# Altium project Solar Panel Cubesat.PrjPcb
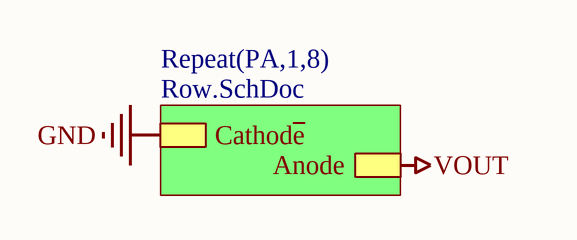
[diagram p0: Panel.SchDoc]
2 sheets, 208 parts. Net scope: hierarchical (ports join the sheet entries above them; power ports are global).
Board file: Panel.PcbDoc
Sheets:
  Panel.SchDoc
    PA1 = Row.SchDoc
    PA2 = Row.SchDoc
    PA3 = Row.SchDoc
    PA4 = Row.SchDoc
    PA5 = Row.SchDoc
    PA6 = Row.SchDoc
    PA7 = Row.SchDoc
    PA8 = Row.SchDoc

## Sheet Panel.SchDoc
size A4

### Sub-sheets
Repeat(PA,1,8) = Row.SchDoc: Cathod~{e}, Anode

## Sheet Row.SchDoc
size A4
Used 8 times, as channels PA1, PA2, PA3, PA4, PA5, PA6, PA7, PA8. Parts and nets are listed once, with the designators drawn on the sheet.
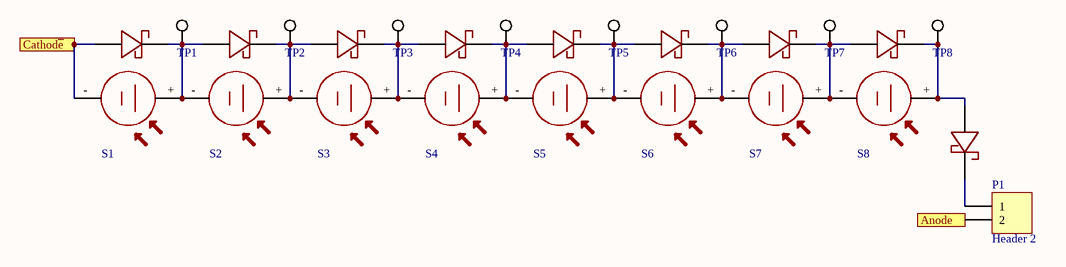
[diagram p1: Row.SchDoc]

### Parts
D1  SCHOTTKY_DIODE_B120-FDICT-NDSCHOTTKY_DIODE_B120-FDICT-ND  [SB_DIODE]  (value not drawn)
D2  SCHOTTKY_DIODE_B120-FDICT-NDSCHOTTKY_DIODE_B120-FDICT-ND  [SB_DIODE]  (value not drawn)
D3  SCHOTTKY_DIODE_B120-FDICT-NDSCHOTTKY_DIODE_B120-FDICT-ND  [SB_DIODE]  (value not drawn)
D4  SCHOTTKY_DIODE_B120-FDICT-NDSCHOTTKY_DIODE_B120-FDICT-ND  [SB_DIODE]  (value not drawn)
D5  SCHOTTKY_DIODE_B120-FDICT-NDSCHOTTKY_DIODE_B120-FDICT-ND  [SB_DIODE]  (value not drawn)
D6  SCHOTTKY_DIODE_B120-FDICT-NDSCHOTTKY_DIODE_B120-FDICT-ND  [SB_DIODE]  (value not drawn)
D7  SCHOTTKY_DIODE_B120-FDICT-NDSCHOTTKY_DIODE_B120-FDICT-ND  [SB_DIODE]  (value not drawn)
D8  SCHOTTKY_DIODE_B120-FDICT-NDSCHOTTKY_DIODE_B120-FDICT-ND  [SB_DIODE]  (value not drawn)
D9  SCHOTTKY_DIODE_B120-FDICT-NDSCHOTTKY_DIODE_B120-FDICT-ND  [SB_DIODE]  (value not drawn)
P1  Header 2  [HDR1X2]
S1  SOLAR_CELL  [SOLAR_CELL]  (value not drawn)
S2  SOLAR_CELL  [SOLAR_CELL]  (value not drawn)
S3  SOLAR_CELL  [SOLAR_CELL]  (value not drawn)
S4  SOLAR_CELL  [SOLAR_CELL]  (value not drawn)
S5  SOLAR_CELL  [SOLAR_CELL]  (value not drawn)
S6  SOLAR_CELL  [SOLAR_CELL]  (value not drawn)
S7  SOLAR_CELL  [SOLAR_CELL]  (value not drawn)
S8  SOLAR_CELL  [SOLAR_CELL]  (value not drawn)
TP1  TEST_POINT  [TEST_POINT]  (value not drawn)
TP2  TEST_POINT  [TEST_POINT]  (value not drawn)
TP3  TEST_POINT  [TEST_POINT]  (value not drawn)
TP4  TEST_POINT  [TEST_POINT]  (value not drawn)
TP5  TEST_POINT  [TEST_POINT]  (value not drawn)
TP6  TEST_POINT  [TEST_POINT]  (value not drawn)
TP7  TEST_POINT  [TEST_POINT]  (value not drawn)
TP8  TEST_POINT  [TEST_POINT]  (value not drawn)

### Ports
Anode, Cathod~{e}

### Nets
Anode: P1.2 ; port Anode
Cathod~{e}: D1.POS S1.- ; port Cathod~{e}
NetD1_NEG: D1.NEG D2.POS S1.+ S2.- TP1.38
NetD2_NEG: D2.NEG D3.POS S2.+ S3.- TP2.38
NetD3_NEG: D3.NEG D4.POS S3.+ S4.- TP3.38
NetD4_NEG: D4.NEG D5.POS S4.+ S5.- TP4.38
NetD5_NEG: D5.NEG D6.POS S5.+ S6.- TP5.38
NetD6_NEG: D6.NEG D7.POS S6.+ S7.- TP6.38
NetD7_NEG: D7.NEG D8.POS S7.+ S8.- TP7.38
NetD8_NEG: D8.NEG D9.POS S8.+ TP8.38
NetD9_NEG: D9.NEG P1.1

### Channels
PA1: designators D1=PA1_D1 D2=PA1_D2 D3=PA1_D3 D4=PA1_D4 D5=PA1_D5 D6=PA1_D6 D7=PA1_D7 D8=PA1_D8 D9=PA1_D9 P1=PA1_P1 S1=PA1_S1 S2=PA1_S2 S3=PA1_S3 S4=PA1_S4 S5=PA1_S5 S6=PA1_S6 S7=PA1_S7 S8=PA1_S8 TP1=PA1_TP1 TP2=PA1_TP2 TP3=PA1_TP3 TP4=PA1_TP4 TP5=PA1_TP5 TP6=PA1_TP6 TP7=PA1_TP7 TP8=PA1_TP8; ports Anode=VOUT Cathod~{e}=GND
PA2: designators D1=PA2_D1 D2=PA2_D2 D3=PA2_D3 D4=PA2_D4 D5=PA2_D5 D6=PA2_D6 D7=PA2_D7 D8=PA2_D8 D9=PA2_D9 P1=PA2_P1 S1=PA2_S1 S2=PA2_S2 S3=PA2_S3 S4=PA2_S4 S5=PA2_S5 S6=PA2_S6 S7=PA2_S7 S8=PA2_S8 TP1=PA2_TP1 TP2=PA2_TP2 TP3=PA2_TP3 TP4=PA2_TP4 TP5=PA2_TP5 TP6=PA2_TP6 TP7=PA2_TP7 TP8=PA2_TP8; ports Anode=VOUT Cathod~{e}=GND
PA3: designators D1=PA3_D1 D2=PA3_D2 D3=PA3_D3 D4=PA3_D4 D5=PA3_D5 D6=PA3_D6 D7=PA3_D7 D8=PA3_D8 D9=PA3_D9 P1=PA3_P1 S1=PA3_S1 S2=PA3_S2 S3=PA3_S3 S4=PA3_S4 S5=PA3_S5 S6=PA3_S6 S7=PA3_S7 S8=PA3_S8 TP1=PA3_TP1 TP2=PA3_TP2 TP3=PA3_TP3 TP4=PA3_TP4 TP5=PA3_TP5 TP6=PA3_TP6 TP7=PA3_TP7 TP8=PA3_TP8; ports Anode=VOUT Cathod~{e}=GND
PA4: designators D1=PA4_D1 D2=PA4_D2 D3=PA4_D3 D4=PA4_D4 D5=PA4_D5 D6=PA4_D6 D7=PA4_D7 D8=PA4_D8 D9=PA4_D9 P1=PA4_P1 S1=PA4_S1 S2=PA4_S2 S3=PA4_S3 S4=PA4_S4 S5=PA4_S5 S6=PA4_S6 S7=PA4_S7 S8=PA4_S8 TP1=PA4_TP1 TP2=PA4_TP2 TP3=PA4_TP3 TP4=PA4_TP4 TP5=PA4_TP5 TP6=PA4_TP6 TP7=PA4_TP7 TP8=PA4_TP8; ports Anode=VOUT Cathod~{e}=GND
PA5: designators D1=PA5_D1 D2=PA5_D2 D3=PA5_D3 D4=PA5_D4 D5=PA5_D5 D6=PA5_D6 D7=PA5_D7 D8=PA5_D8 D9=PA5_D9 P1=PA5_P1 S1=PA5_S1 S2=PA5_S2 S3=PA5_S3 S4=PA5_S4 S5=PA5_S5 S6=PA5_S6 S7=PA5_S7 S8=PA5_S8 TP1=PA5_TP1 TP2=PA5_TP2 TP3=PA5_TP3 TP4=PA5_TP4 TP5=PA5_TP5 TP6=PA5_TP6 TP7=PA5_TP7 TP8=PA5_TP8; ports Anode=VOUT Cathod~{e}=GND
PA6: designators D1=PA6_D1 D2=PA6_D2 D3=PA6_D3 D4=PA6_D4 D5=PA6_D5 D6=PA6_D6 D7=PA6_D7 D8=PA6_D8 D9=PA6_D9 P1=PA6_P1 S1=PA6_S1 S2=PA6_S2 S3=PA6_S3 S4=PA6_S4 S5=PA6_S5 S6=PA6_S6 S7=PA6_S7 S8=PA6_S8 TP1=PA6_TP1 TP2=PA6_TP2 TP3=PA6_TP3 TP4=PA6_TP4 TP5=PA6_TP5 TP6=PA6_TP6 TP7=PA6_TP7 TP8=PA6_TP8; ports Anode=VOUT Cathod~{e}=GND
PA7: designators D1=PA7_D1 D2=PA7_D2 D3=PA7_D3 D4=PA7_D4 D5=PA7_D5 D6=PA7_D6 D7=PA7_D7 D8=PA7_D8 D9=PA7_D9 P1=PA7_P1 S1=PA7_S1 S2=PA7_S2 S3=PA7_S3 S4=PA7_S4 S5=PA7_S5 S6=PA7_S6 S7=PA7_S7 S8=PA7_S8 TP1=PA7_TP1 TP2=PA7_TP2 TP3=PA7_TP3 TP4=PA7_TP4 TP5=PA7_TP5 TP6=PA7_TP6 TP7=PA7_TP7 TP8=PA7_TP8; ports Anode=VOUT Cathod~{e}=GND
PA8: designators D1=PA8_D1 D2=PA8_D2 D3=PA8_D3 D4=PA8_D4 D5=PA8_D5 D6=PA8_D6 D7=PA8_D7 D8=PA8_D8 D9=PA8_D9 P1=PA8_P1 S1=PA8_S1 S2=PA8_S2 S3=PA8_S3 S4=PA8_S4 S5=PA8_S5 S6=PA8_S6 S7=PA8_S7 S8=PA8_S8 TP1=PA8_TP1 TP2=PA8_TP2 TP3=PA8_TP3 TP4=PA8_TP4 TP5=PA8_TP5 TP6=PA8_TP6 TP7=PA8_TP7 TP8=PA8_TP8; ports Anode=VOUT Cathod~{e}=GND

### Library data of the parts
D1-D9 = SCHOTTKY_DIODE_B120-FDICT-NDSCHOTTKY_DIODE_B120-FDICT-ND: GateName_1: G$1; SymbolName_1: SCHOTTKY_DIODE_B120-FDICT-ND; DeviceName: SCHOTTKY_DIODE_B120-FDICT-ND; LibraryName: Solar_Fadi; DeviceSetName: SCHOTTKY_DIODE_B120-FDICT-ND; Package: SCHOTTKY_DIODE_B120-FDICT-ND
P1 = Header 2: Header, 2-Pin; LatestRevisionDate: 17-Jul-2002; LatestRevisionNote: Re-released for DXP Platform.; Publisher: Altium Limited
S1-S8 = SOLAR_CELL: pin to pad: +>POS ->NEG
TP1-TP8 = TEST_POINT: pin to pad: 38>PAD

## Nets that join several sheets
GND: PA1 (PA1_D1.POS PA1_S1.-), PA2 (PA2_D1.POS PA2_S1.-), PA3 (PA3_D1.POS PA3_S1.-), PA4 (PA4_D1.POS PA4_S1.-), PA5 (PA5_D1.POS PA5_S1.-), PA6 (PA6_D1.POS PA6_S1.-), PA7 (PA7_D1.POS PA7_S1.-), PA8 (PA8_D1.POS PA8_S1.-)
VOUT: PA1 (PA1_P1.2), PA2 (PA2_P1.2), PA3 (PA3_P1.2), PA4 (PA4_P1.2), PA5 (PA5_P1.2), PA6 (PA6_P1.2), PA7 (PA7_P1.2), PA8 (PA8_P1.2)